# Altium schematic sheet ESC_Connectors.SchDoc
size A4; SheetNumber: 6; SheetTotal: 6
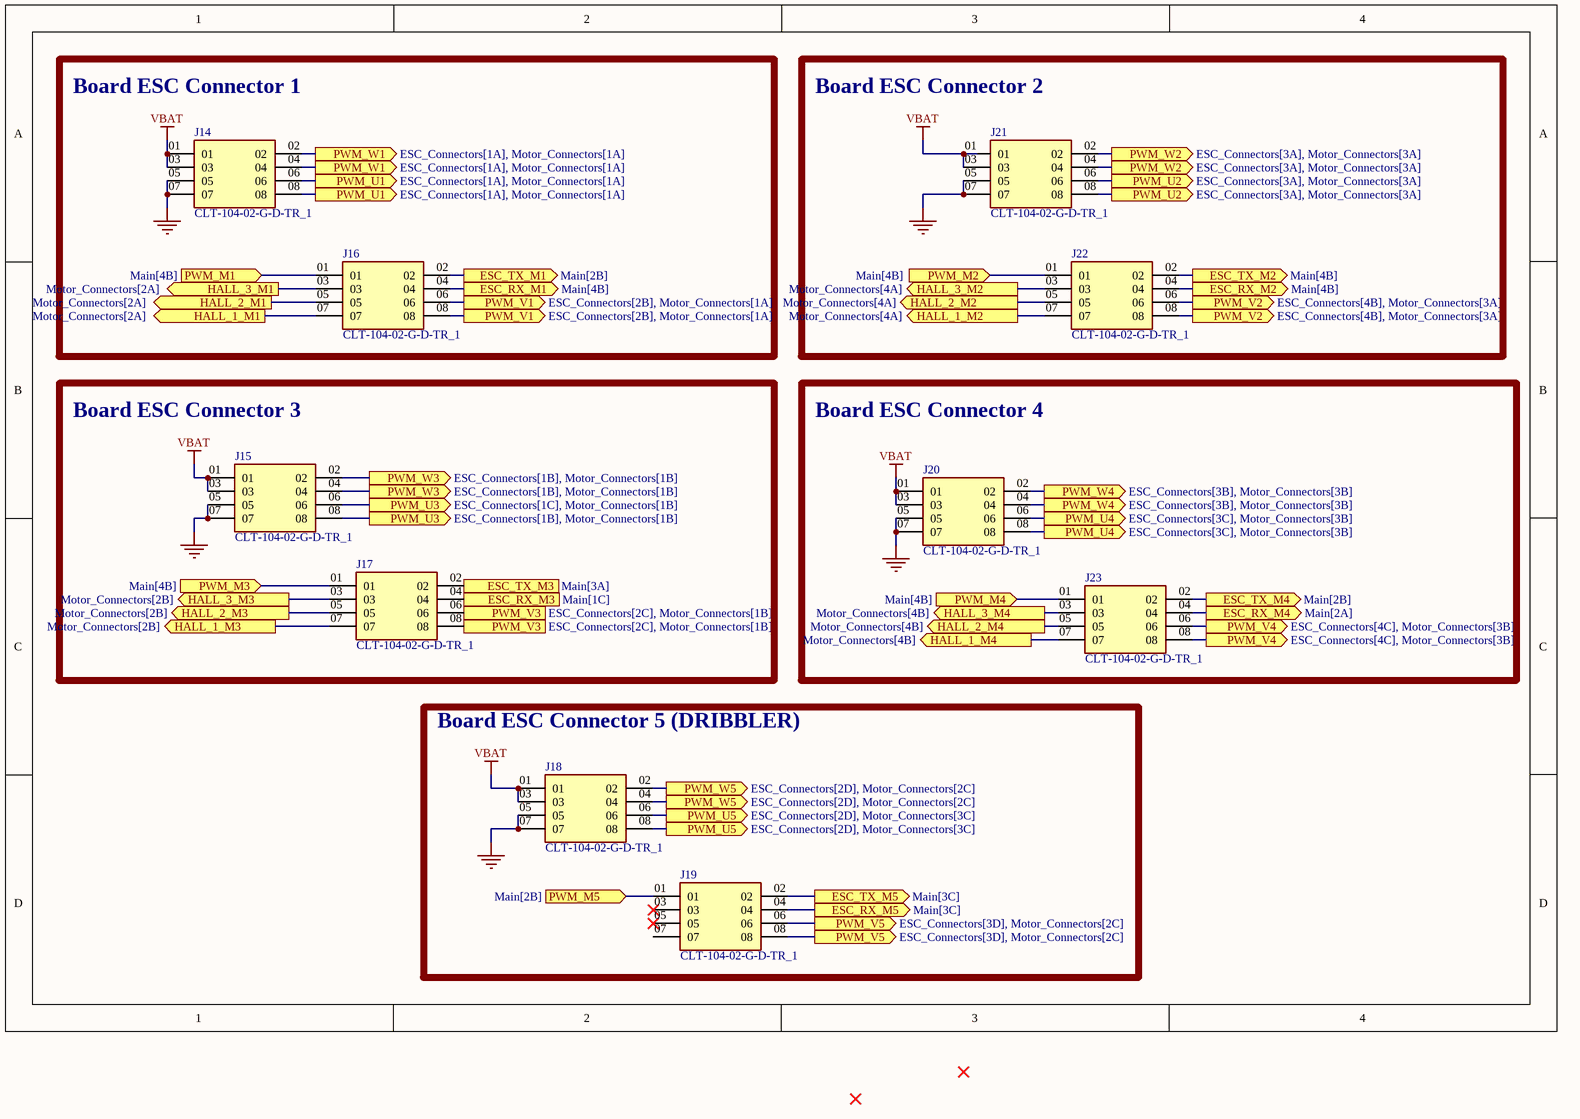
[diagram p0: ESC_Connectors.SchDoc]

## Parts
J14  CLT-104-02-G-D-TR_1  [CLT-104-02-G-D-TR]
J15  CLT-104-02-G-D-TR_1  [CLT-104-02-G-D-TR]
J16  CLT-104-02-G-D-TR_1  [CLT-104-02-G-D-TR]
J17  CLT-104-02-G-D-TR_1  [CLT-104-02-G-D-TR]
J18  CLT-104-02-G-D-TR_1  [CLT-104-02-G-D-TR]
J19  CLT-104-02-G-D-TR_1  [CLT-104-02-G-D-TR]
J20  CLT-104-02-G-D-TR_1  [CLT-104-02-G-D-TR]
J21  CLT-104-02-G-D-TR_1  [CLT-104-02-G-D-TR]
J22  CLT-104-02-G-D-TR_1  [CLT-104-02-G-D-TR]
J23  CLT-104-02-G-D-TR_1  [CLT-104-02-G-D-TR]

## Blocks framed on the sheet
Board ESC Connector 1: J14 J16
Board ESC Connector 2: J21 J22
Board ESC Connector 3: J15 J17
Board ESC Connector 4: J20 J23
Board ESC Connector 5 (DRIBBLER): J18 J19

## Ports
ESC_RX_M1 (out, see Main[4B]), ESC_RX_M2 (out, see Main[4B]), ESC_RX_M3 (out, see Main[1C]), ESC_RX_M4 (out, see Main[2A]), ESC_RX_M5 (out, see Main[3C]), ESC_TX_M1 (out, see Main[2B]), ESC_TX_M2 (out, see Main[4B]), ESC_TX_M3 (out, see Main[3A]), ESC_TX_M4 (out, see Main[2B]), ESC_TX_M5 (out, see Main[3C]), HALL_1_M1 (out, see Motor_Connectors[2A]), HALL_1_M2 (out, see Motor_Connectors[4A]), HALL_1_M3 (out, see Motor_Connectors[2B]), HALL_1_M4 (out, see Motor_Connectors[4B]), HALL_2_M1 (out, see Motor_Connectors[2A]), HALL_2_M2 (out, see Motor_Connectors[4A]), HALL_2_M3 (out, see Motor_Connectors[2B]), HALL_2_M4 (out, see Motor_Connectors[4B]), HALL_3_M1 (out, see Motor_Connectors[2A]), HALL_3_M2 (out, see Motor_Connectors[4A]), HALL_3_M3 (out, see Motor_Connectors[2B]), HALL_3_M4 (out, see Motor_Connectors[4B]), PWM_M1 (in, see Main[4B]), PWM_M2 (in, see Main[4B]), PWM_M3 (in, see Main[4B]), PWM_M4 (in, see Main[4B]), PWM_M5 (in, see Main[2B]), PWM_U1 (out, see ESC_Connectors[1A], Motor_Connectors[1A]), PWM_U2 (out, see ESC_Connectors[3A], Motor_Connectors[3A]), PWM_U3 (out, see ESC_Connectors[1B], Motor_Connectors[1B]), PWM_U3 (out, see ESC_Connectors[1C], Motor_Connectors[1B]), PWM_U4 (out, see ESC_Connectors[3C], Motor_Connectors[3B]), PWM_U5 (out, see ESC_Connectors[2D], Motor_Connectors[3C]), PWM_V1 (out, see ESC_Connectors[2B], Motor_Connectors[1A]), PWM_V2 (out, see ESC_Connectors[4B], Motor_Connectors[3A]), PWM_V3 (out, see ESC_Connectors[2C], Motor_Connectors[1B]), PWM_V4 (out, see ESC_Connectors[4C], Motor_Connectors[3B]), PWM_V5 (out, see ESC_Connectors[3D], Motor_Connectors[2C]), PWM_W1 (out, see ESC_Connectors[1A], Motor_Connectors[1A]), PWM_W2 (out, see ESC_Connectors[3A], Motor_Connectors[3A]), PWM_W3 (out, see ESC_Connectors[1B], Motor_Connectors[1B]), PWM_W4 (out, see ESC_Connectors[3B], Motor_Connectors[3B]), PWM_W5 (out, see ESC_Connectors[2D], Motor_Connectors[2C])

## Nets
GND: J14.05 J14.07 J15.05 J15.07 J18.05 J18.07 J20.05 J20.07 J21.05 J21.07
VBAT: J14.01 J14.03 J15.01 J15.03 J18.01 J18.03 J20.01 J20.03 J21.01 J21.03
ESC_RX_M1: J16.04 ; port ESC_RX_M1
ESC_RX_M2: J22.04 ; port ESC_RX_M2
ESC_RX_M3: J17.04 ; port ESC_RX_M3
ESC_RX_M4: J23.04 ; port ESC_RX_M4
ESC_RX_M5: J19.04 ; port ESC_RX_M5
ESC_TX_M1: J16.02 ; port ESC_TX_M1
ESC_TX_M2: J22.02 ; port ESC_TX_M2
ESC_TX_M3: J17.02 ; port ESC_TX_M3
ESC_TX_M4: J23.02 ; port ESC_TX_M4
ESC_TX_M5: J19.02 ; port ESC_TX_M5
HALL_1_M1: J16.07 ; port HALL_1_M1
HALL_1_M2: J22.07 ; port HALL_1_M2
HALL_1_M3: J17.07 ; port HALL_1_M3
HALL_1_M4: J23.07 ; port HALL_1_M4
HALL_2_M1: J16.05 ; port HALL_2_M1
HALL_2_M2: J22.05 ; port HALL_2_M2
HALL_2_M3: J17.05 ; port HALL_2_M3
HALL_2_M4: J23.05 ; port HALL_2_M4
HALL_3_M1: J16.03 ; port HALL_3_M1
HALL_3_M2: J22.03 ; port HALL_3_M2
HALL_3_M3: J17.03 ; port HALL_3_M3
HALL_3_M4: J23.03 ; port HALL_3_M4
PWM_M1: J16.01 ; port PWM_M1
PWM_M2: J22.01 ; port PWM_M2
PWM_M3: J17.01 ; port PWM_M3
PWM_M4: J23.01 ; port PWM_M4
PWM_M5: J19.01 ; port PWM_M5
PWM_U1: J14.06 J14.08 ; port PWM_U1
PWM_U2: J21.06 J21.08 ; port PWM_U2
PWM_U3: J15.06 J15.08 ; port PWM_U3
PWM_U4: J20.06 J20.08 ; port PWM_U4
PWM_U5: J18.06 J18.08 ; port PWM_U5
PWM_V1: J16.06 J16.08 ; port PWM_V1
PWM_V2: J22.06 J22.08 ; port PWM_V2
PWM_V3: J17.06 J17.08 ; port PWM_V3
PWM_V4: J23.06 J23.08 ; port PWM_V4
PWM_V5: J19.06 J19.08 ; port PWM_V5
PWM_W1: J14.02 J14.04 ; port PWM_W1
PWM_W2: J21.02 J21.04 ; port PWM_W2
PWM_W3: J15.02 J15.04 ; port PWM_W3
PWM_W4: J20.02 J20.04 ; port PWM_W4
PWM_W5: J18.02 J18.04 ; port PWM_W5

Not connected (* = marked no-connect by the designer): J19 03* 05* 07

## Library data of the parts
J14-J23 = CLT-104-02-G-D-TR_1: 8 Position Receptacle Connector 0.079 (2.00mm) Surface Mount Gold; MF: Samtec; SnapEDA_Link: https://www.snapeda.com/parts/CLT-104-02-G-D-TR/Samtec/view-part/?ref=snap; Package: None; Value: *; MP: CLT-104-02-G-D-TR; Check_prices: https://www.snapeda.com/parts/CLT-104-02-G-D-TR/Samtec/view-part/?ref=eda